# Altium schematic sheet XLIN1.7-2048SQ TE0_MEZ.SchDoc
size A3; Address1: Address1; Address2: Address2; Address3: Address3; Address4: Address4; DocumentNumber: АБВГ.123456.001 Э3; SheetNumber: 1; Scale: 1:1; DocumentType: Схема электрическая принципиальная; FirstReferrence: АБВГ.123456.001
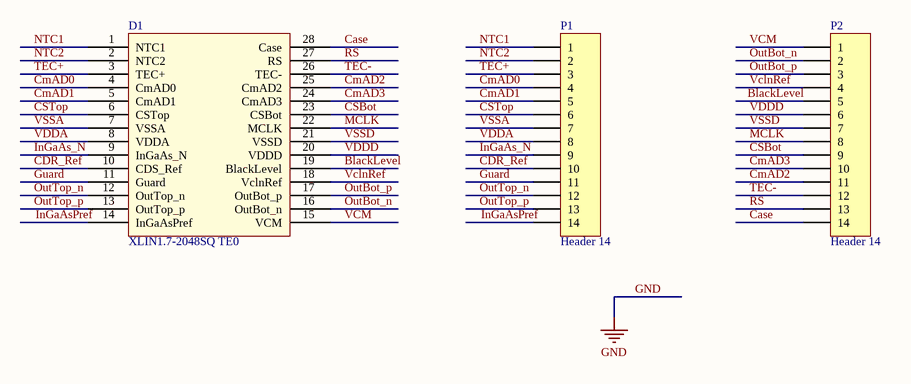
[diagram p0: XLIN1.7-2048SQ TE0_MEZ.SchDoc]

## Parts
D1  XLIN1.7-2048SQ TE0  [XLIN1.7-2048SQ TE0]
P1  Header 14  [HDR1X14]
P2  Header 14  [HDR1X14]

## Nets
BlackLevel: D1.19(BlackLevel) P2.5
Case: D1.28(Case) P2.14
CDR_Ref: D1.10(CDS_Ref) P1.10
CmAD0: D1.4(CmAD0) P1.4
CmAD1: D1.5(CmAD1) P1.5
CmAD2: D1.25(CmAD2) P2.11
CmAD3: D1.24(CmAD3) P2.10
CSBot: D1.23(CSBot) P2.9
CSTop: D1.6(CSTop) P1.6
Guard: D1.11(Guard) P1.11
InGaAs_N: D1.9(InGaAs_N) P1.9
InGaAsPref: D1.14(InGaAsPref) P1.14
MCLK: D1.22(MCLK) P2.8
NTC1: D1.1(NTC1) P1.1
NTC2: D1.2(NTC2) P1.2
OutBot_n: D1.16(OutBot_n) P2.2
OutBot_p: D1.17(OutBot_p) P2.3
OutTop_n: D1.12(OutTop_n) P1.12
OutTop_p: D1.13(OutTop_p) P1.13
RS: D1.27(RS) P2.13
TEC+: D1.3(TEC+) P1.3
TEC-: D1.26(TEC-) P2.12
VclnRef: D1.18(VclnRef) P2.4
VCM: D1.15(VCM) P2.1
VDDA: D1.8(VDDA) P1.8
VDDD: D1.20(VDDD) P2.6
VSSA: D1.7(VSSA) P1.7
VSSD: D1.21(VSSD) P2.7

## Notes on the sheet
- Title
- Size:
- Date:
- A3
- Number:
- Time:
- Revision:
- Sheet
- of
- File:

## Library data of the parts
P1 P2 = Header 14: Header, 14-Pin; LatestRevisionDate: 17-Jul-2002; LatestRevisionNote: Re-released for DXP Platform.; Publisher: Altium Limited